# Altium schematic sheet CONTROLLER.SchDoc
size A3
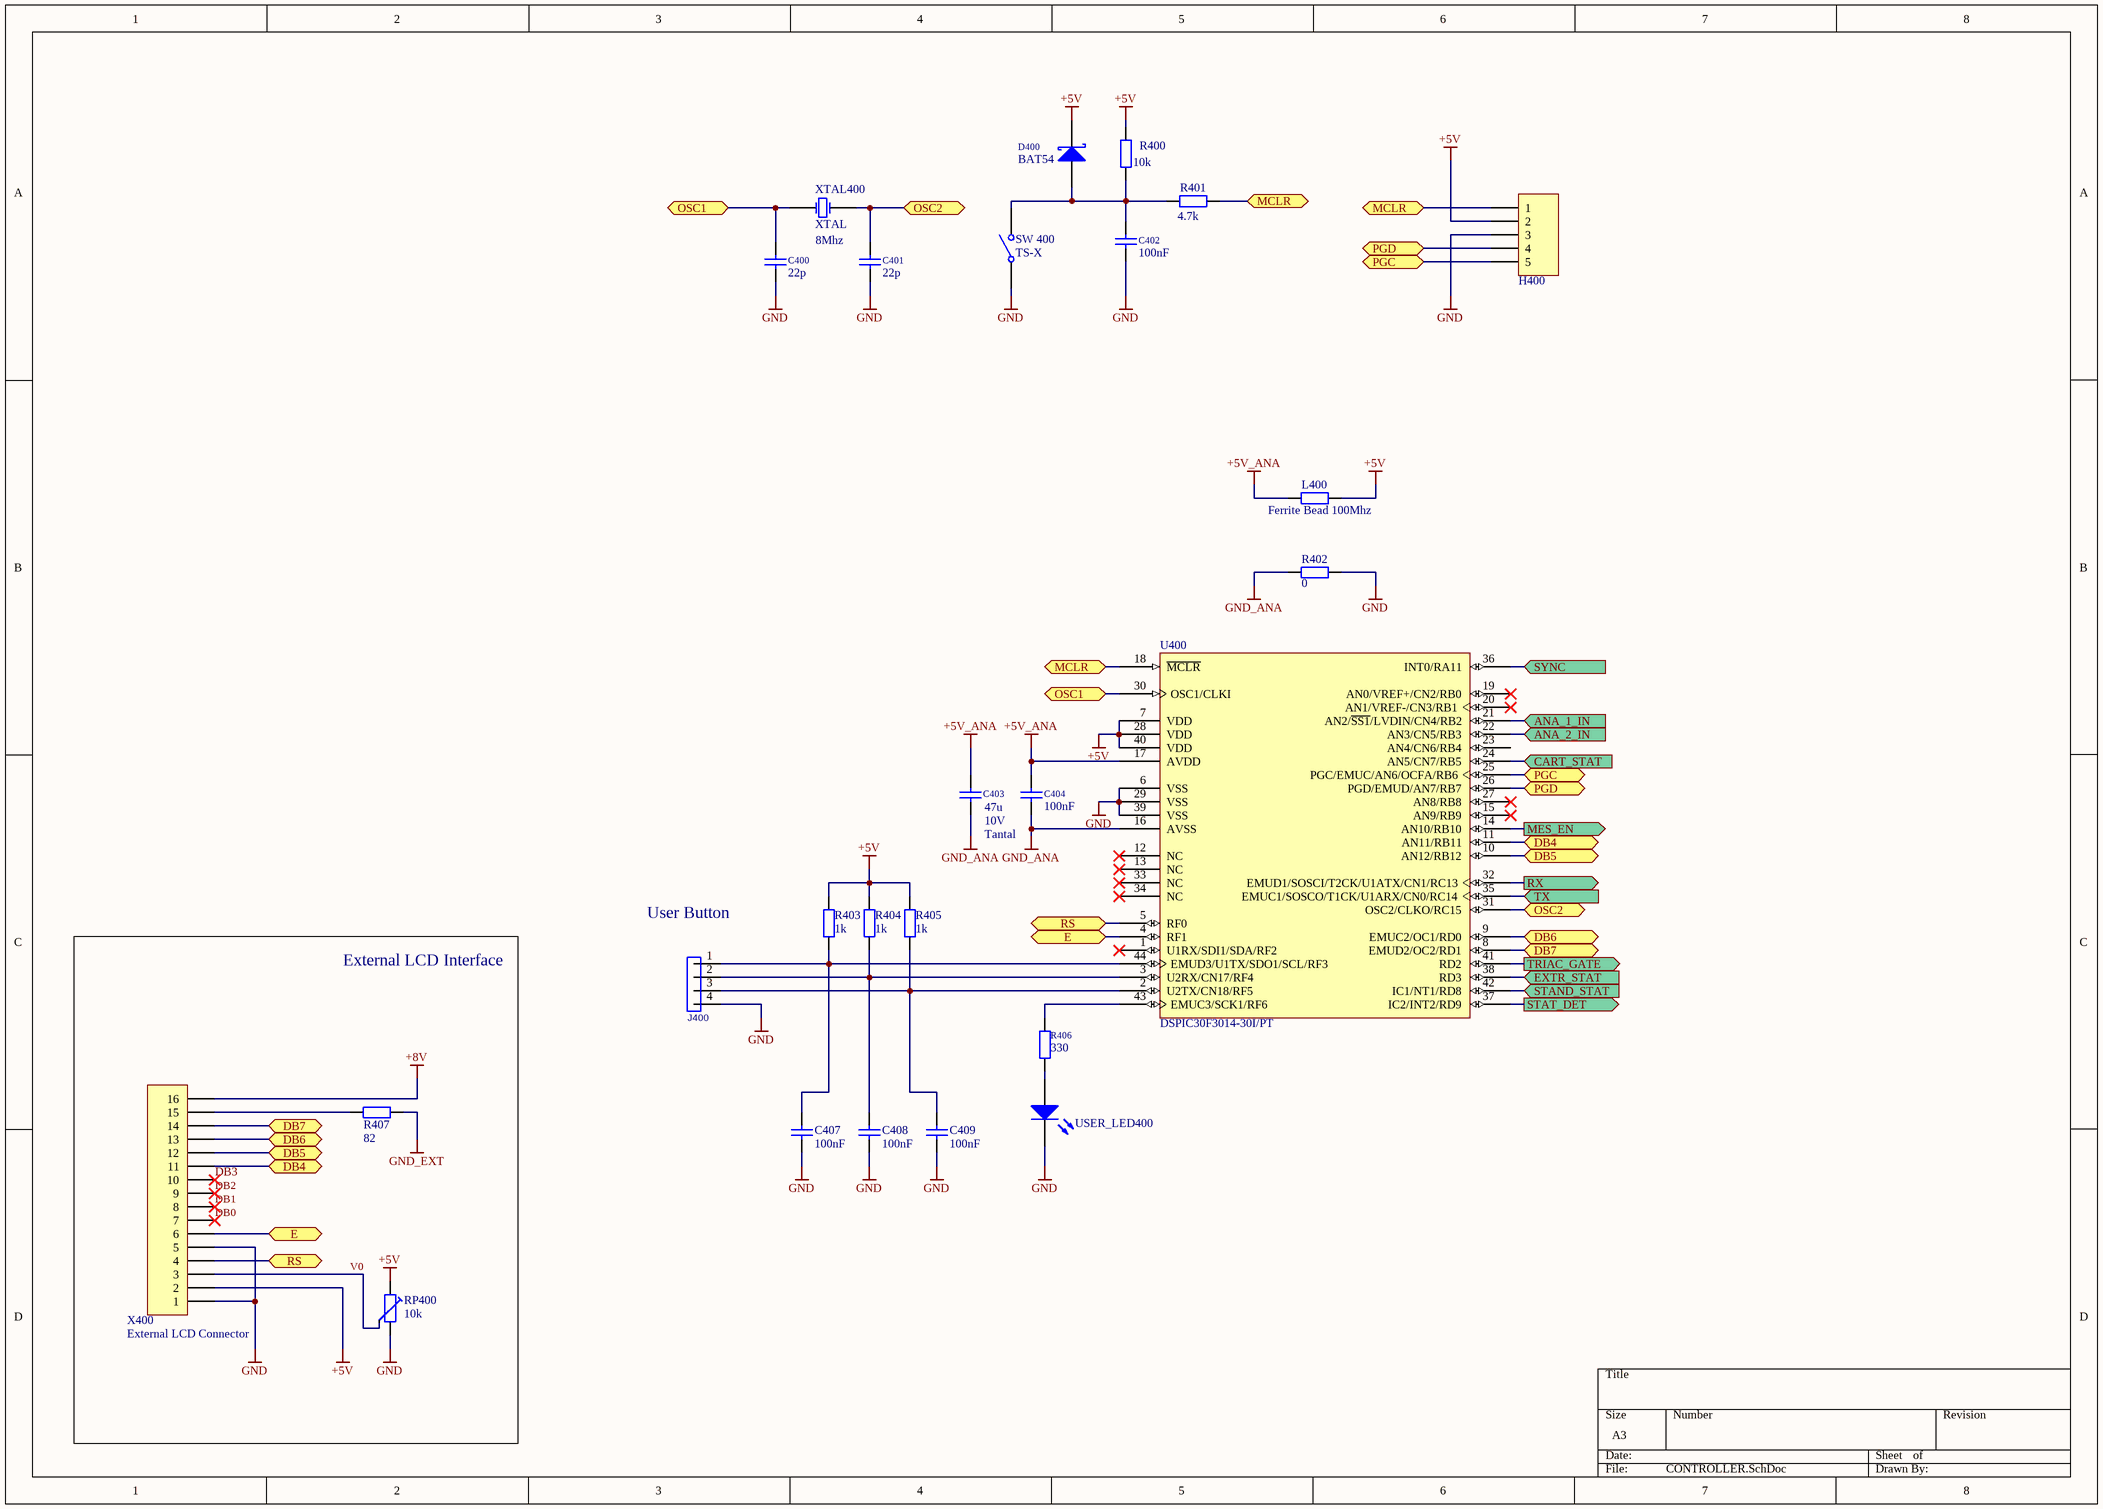
[diagram p0: CONTROLLER.SchDoc]

## Parts
C400  value 22p  [3216[1206]]  (hidden comment: Cap)
C401  value 22p  [3216[1206]]  (hidden comment: Cap)
C402  value 100nF  [3216[1206]]  (hidden comment: Cap)
C403  value 47u  Voltage: 10V  Type: Tantal  [3216[1206]]  (hidden comment: Cap)
C404  value 100nF  [3216[1206]]  (hidden comment: Cap)
C407  value 100nF  [3216[1206]]  (hidden comment: Cap 1206)
C408  value 100nF  [3216[1206]]  (hidden comment: Cap 1206)
C409  value 100nF  [3216[1206]]  (hidden comment: Cap 1206)
D400  BAT54  [SOT23]
H400  HEADER X5  [SIP5]  (value not drawn)
J400  SIP4  [SIP4]  (value not drawn)
L400  value Ferrite Bead 100Mhz  [3216[1206]]  (hidden comment: RES)
R400  value 10k  [3216[1206]]  (hidden comment: RES)
R401  value 4.7k  [3216[1206]]  (hidden comment: RES)
R402  value 0  [3216[1206]]  (hidden comment: RES)
R403  value 1k  [3216[1206]]  (hidden comment: RES)
R404  value 1k  [3216[1206]]  (hidden comment: RES)
R405  value 1k  [3216[1206]]  (hidden comment: RES)
R406  value 330  [3216[1206]]  (hidden comment: Resistor)
R407  value 82  [1206_REFLOW]  (hidden comment: RES)
RP400  value 10k  [BOURNS3296W]  (hidden comment: Trimmer)
SW_400  value TS-X  [TS Button]  (hidden comment: Tack Button 6x6)
U400  DSPIC30F3014-30I/PT  [TQFP-PT44_M]
USER_LED400  LED  [LED_1206]  (value not drawn)
X400  HEADER X16  [HDR1X16]  (value not drawn)
XTAL400  XTAL  value 8Mhz  [XTAL]

## Blocks framed on the sheet
External LCD Interface: R407 RP400 X400

## Ports
ANA_1_IN (in), ANA_2_IN (in), CART_STAT (in), DB4 (bidir), DB5 (bidir), DB6 (bidir), DB7 (bidir), E (bidir), EXTR_STAT (in), MCLR (bidir), MES_EN (out), OSC1 (bidir), OSC2 (bidir), PGC (bidir), PGD (bidir), RS (bidir), RX (out), STAND_STAT (in), STAT_DET (out), SYNC (in), TRIAC_GATE (out), TX (in)

## Nets
+5V: D400.3(K) H400.2 L400.2 R400.1 R403.2 R404.2 R405.2 RP400.3 U400.7(VDD) U400.28(VDD) U400.40(VDD) X400.2
+5V_ANA: C403.2 C404.2 L400.1 U400.17(AVDD)
+8V: X400.16
GND: C400.1 C401.1 C402.1 C407.1 C408.1 C409.1 H400.3 J400.4 R402.2 RP400.1 SW_400.1(COMMON) U400.6(VSS) U400.29(VSS) U400.39(VSS) USER_LED400.K X400.1 X400.5
GND_ANA: C403.1 C404.1 R402.1 U400.16(AVSS)
GND_EXT: R407.2
ANA_1_IN: U400.21(AN2/~{SS1}/LVDIN/CN4/RB2) ; port ANA_1_IN
ANA_2_IN: U400.22(AN3/CN5/RB3) ; port ANA_2_IN
CART_STAT: U400.24(AN5/CN7/RB5) ; port CART_STAT
DB0: X400.7
DB1: X400.8
DB2: X400.9
DB3: X400.10
DB4: U400.11(AN11/RB11) X400.11 ; port DB4
DB5: U400.10(AN12/RB12) X400.12 ; port DB5
DB6: U400.9(EMUC2/OC1/RD0) X400.13 ; port DB6
DB7: U400.8(EMUD2/OC2/RD1) X400.14 ; port DB7
E: U400.4(RF1) X400.6 ; port E
EXTR_STAT: U400.38(RD3) ; port EXTR_STAT
MCLR: H400.1 R401.2 U400.18(~{MCLR}) ; port MCLR
MES_EN: U400.14(AN10/RB10) ; port MES_EN
OSC1: C400.2 U400.30(OSC1/CLKI) XTAL400.1(OSC1) ; port OSC1
OSC2: C401.2 U400.31(OSC2/CLKO/RC15) XTAL400.2(OSC2) ; port OSC2
PGC: H400.5 U400.25(PGC/EMUC/AN6/OCFA/RB6) ; port PGC
PGD: H400.4 U400.26(PGD/EMUD/AN7/RB7) ; port PGD
RS: U400.5(RF0) X400.4 ; port RS
RX: U400.32(EMUD1/SOSCI/T2CK/U1ATX/CN1/RC13) ; port RX
STAND_STAT: U400.42(IC1/NT1/RD8) ; port STAND_STAT
STAT_DET: U400.37(IC2/INT2/RD9) ; port STAT_DET
SYNC: U400.36(INT0/RA11) ; port SYNC
TRIAC_GATE: U400.41(RD2) ; port TRIAC_GATE
TX: U400.35(EMUC1/SOSCO/T1CK/U1ARX/CN0/RC14) ; port TX
V0: RP400.2 X400.3
NetC402_2: C402.2 D400.1(A) R400.2 R401.1 SW_400.4(NO)
NetC407_2: C407.2 J400.1 R403.1 U400.44(EMUD3/U1TX/SDO1/SCL/RF3)
NetC408_2: C408.2 J400.2 R404.1 U400.3(U2RX/CN17/RF4)
NetC409_2: C409.2 J400.3 R405.1 U400.2(U2TX/CN18/RF5)
NetR406_1: R406.1 U400.43(EMUC3/SCK1/RF6)
NetR406_2: R406.2 USER_LED400.A
NetR407_1: R407.1 X400.15

Not connected (* = marked no-connect by the designer): U400 1(U1RX/SDI1/SDA/RF2)* 12(NC)* 13(NC)* 15(AN9/RB9)* 19(AN0/VREF+/CN2/RB0)* 20(AN1/VREF-/CN3/RB1)* 23(AN4/CN6/RB4) 27(AN8/RB8)* 33(NC)* 34(NC)*

## Notes on the sheet
- (near J400) User Button
- (near X400) External LCD Connector

## Library data of the parts
L400 R400-R405 R407 = RES 1
R406 = RES1
RP400 = Res Trim
SW_400 = TS-X Button
U400 = DSPIC30F3014-30I/PT: High-Performance 16-bit Digital Signal Controller, 24 KB Flash, 2 KB SRAM, 1 KB EEPROM, 44-Pin TQFP, Industrial Temperature; Published: 29-Jan-2009; DatasheetVersion: revF, Apr-2008; PackageVersion: revAW, Oct-2008; PackageReference: TQFP-PT44; Publisher: Altium Limited; PackageDescription: 44-Lead Plastic Thin Quad Flatpack (PT) - 10x10x1mm Body, 2.00mm [TQFP]; Code_JEDEC: MS-026; ComponentLink1Description: Manufacturer Link; ComponentLink1URL: http://www.microchip.com; ComponentLink2Description: Datasheet; ComponentLink2URL: http://ww1.microchip.com/downloads/en/DeviceDoc/70138F.pdf; ComponentLink3Description: Packaging Specification; ComponentLink3URL: http://ww1.microchip.com/downloads/en/PackagingSpec/00049AW.pdf
USER_LED400 = LED: Value: TBD
D400 = BAT54: Value: BAT54
H400 = HEADER X5: Value: HEADER X5
J400 = SIP4: Value: *
X400 = HEADER X16: Value: HEADER X16